# Altium project Monitor_Board_Model_temporary_H202.PrjPcb (part 3 of 3)

## Sheet Sensor_Module.SchDoc: Sensor Module
size A4; DocumentNumber: 7; SheetNumber: 7; SheetTotal: 31
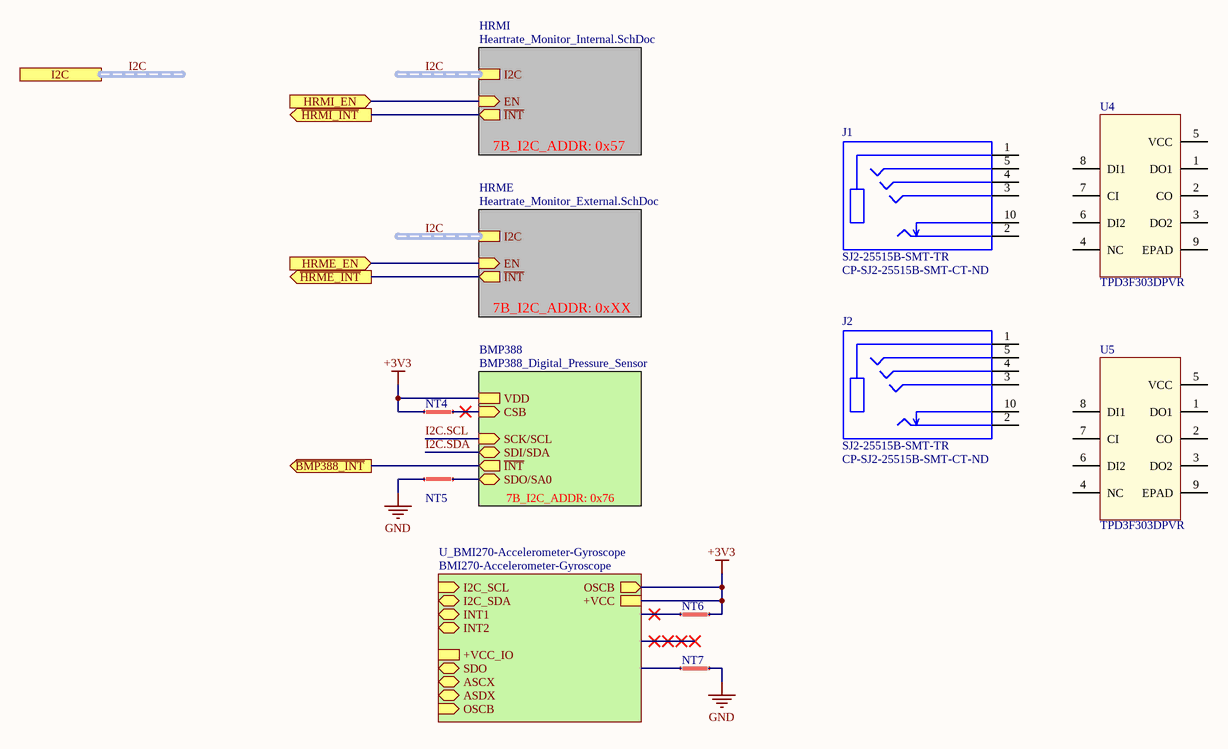
[diagram p11: Sensor_Module.SchDoc]

### Parts
J1  SJ2-25515B-SMT-TR  Supplier Part Number 1: CP-SJ2-25515B-SMT-CT-ND  [CUI_SJ2-25515B-SMT-TR]
J2  SJ2-25515B-SMT-TR  Supplier Part Number 1: CP-SJ2-25515B-SMT-CT-ND  [CUI_SJ2-25515B-SMT-TR]
NT4  Net Tie  [Net Tie 6x30mil]  (value not drawn)  (net tie, no BOM)
NT5  Net Tie  [Net Tie 6x30mil]  (value not drawn)  (net tie, no BOM)
NT6  Net Tie  [Net Tie 6x30mil]  (value not drawn)  (net tie, no BOM)
NT7  Net Tie  [Net Tie 6x30mil]  (value not drawn)  (net tie, no BOM)
U4  TPD3F303DPVR  [DPV8_1P7X0P4]
U5  TPD3F303DPVR  [DPV8_1P7X0P4]

### Sub-sheets
BMP388 = BMP388_Digital_Pressure_Sensor (file not in this document): VDD, SCK/SCL (in), SDI/SDA (bidir), SDO/SA0 (bidir), CSB (in), ~{INT} (out)  | 7B_I2C_ADDR: 0x76
HRME = Heartrate_Monitor_External.SchDoc: I2C (harness I2C), EN (in), ~{INT} (out)  | 7B_I2C_ADDR: 0xXX
HRMI = Heartrate_Monitor_Internal.SchDoc: I2C (harness I2C), EN (in), ~{INT} (out)  | 7B_I2C_ADDR: 0x57
U_BMI270-Accelerometer-Gyroscope = BMI270-Accelerometer-Gyroscope (file not in this document): I2C_SCL (in), I2C_SDA (bidir), INT1 (bidir), INT2 (bidir), +VCC, +VCC_IO, SDO (bidir), ASCX (bidir), ASDX (bidir), OSCB (in), OSCB (out)

### Ports
HRME_EN (in), HRMI_EN (in), I2C (harness I2C), ~{BMP388_INT} (out), ~{HRME_INT} (out), ~{HRMI_INT} (out)

### Nets
+3V3: NT4.1 NT6.2 ; sheet BMP388/VDD, sheet U_BMI270-Accelerometer-Gyroscope/+VCC, sheet U_BMI270-Accelerometer-Gyroscope/OSCB
GND: NT5.2 NT7.2
~{BMP388_INT}: port ~{BMP388_INT}, sheet BMP388/~{INT}
~{HRME_INT}: port ~{HRME_INT}, sheet HRME/~{INT}
~{HRMI_INT}: port ~{HRMI_INT}, sheet HRMI/~{INT}
HRME_EN: port HRME_EN, sheet HRME/EN
HRMI_EN: port HRMI_EN, sheet HRMI/EN
I2C.SCL: sheet BMP388/SCK/SCL
I2C.SDA: sheet BMP388/SDI/SDA
NetNT4_2: NT4.2 ; sheet BMP388/CSB
NetNT5_1: NT5.1 ; sheet BMP388/SDO/SA0

Not connected (* = marked no-connect by the designer): J1 1(OUTER_RING) 2(TIP) 3(RING1) 4(RING2) 5(SLEEVE) 10(TIP_SWITCH); J2 1(OUTER_RING) 2(TIP) 3(RING1) 4(RING2) 5(SLEEVE) 10(TIP_SWITCH); NT6 1*; NT7 1; U4 1(DO1) 2(CO) 3(DO2) 4(NC) 5(VCC) 6(DI2) 7(CI) 8(DI1) 9(EPAD); U5 1(DO1) 2(CO) 3(DO2) 4(NC) 5(VCC) 6(DI2) 7(CI) 8(DI1) 9(EPAD)

### Buses and harness runs
harness I2C = port I2C
harness I2C = sheet HRME/I2C
harness I2C = sheet HRMI/I2C

### Notes on the sheet
- Title
- Size:
- Date:
- A4
- Number:
- Time:
- Revision:
- Sheet
- of
- File:

### Library data of the parts
J1 J2 = SJ2-25515B-SMT-TR: 5 conductor, 2.5 mm, SMT Audio Jack w/ Tip Switch; MF: CUI; Contact: 5(Excludes TIP Switch); Specification: 5-Contact 2.5mm; Package: None; Price: None; Value: *; MP: SJ2-25515B-SMT-TR; Availability: Unavailable; Supplier 1: Digi-Key; Datasheet: https://www.cuidevices.com/product/resource/sj2-2551x-smt.pdf
NT4-NT7 = Net Tie Line: ClassName: Net Tie
U4 U5 = FILTER RC(PI) ESD SMD  8-UFDFN EP: RC (Pi) EMI Filter 2nd Order Low Pass 3 Channel R = 47Ohms, 100Ohms, C = 20pF  8-UFDFN Exposed Pad; Manufacturer: Texas Instruments; Number of Channels: 3; Frequency: 308MHz; ESD Protection: Yes; Operating Supply Voltage: 5.5V; Clamping Voltage: 10V; Supplier 1: Digi-Key; Manufacturer Part Number: TPD3F303DPVR; Stock 1: 4896; Pricing 1: 1=0.85, 10=0.812, 25=0.7856, 50=0.6414, 100=0.576, 250=0.5236, 500=0.4974, 1000=0.4451 (USD); Case/Package: SMD/SMT; Min Operating Temperature: -40°C; Max Operating Temperature: 85°C; Packaging: Tape and Reel; ComponentLink1URL: http://www.ti.com/lit/ds/symlink/tpd3f303.pdf?src-supplier=Digi-Key; ComponentLink1Description: http://www.ti.com/lit/ds/symlink/tpd3f303.pdf?src-supplier=Digi-Key; ComponentLink2URL: http://focus.ti.com/lit/ds/symlink/tpd3f303.pdf?src-supplier=Avnet+Europe; ComponentLink2Description: http://focus.ti.com/lit/ds/symlink/tpd3f303.pdf?src-supplier=Avnet+Europe; ComponentLink3URL: https://www.verical.com/server-webapp/html/getDatasheet?partID=302817&src-supplier=Verical; ComponentLink3Description: https://www.verical.com/server-webapp/html/getDatasheet?partID=302817&src-supplier=Verical; ComponentLink4URL: http://www.farnell.com/datasheets/1558442.pdf?src-supplier=Element14; ComponentLink4Description: http://www.farnell.com/datasheets/1558442.pdf?src-supplier=Element14; Supplier Part Number 1: 296-28299-1-ND; Number of Pins: 8; Contact Plating: Gold; Package Quantity: 1; Capacitance: 20pF; Termination: Flat; Length: 2.2mm; Height: 0.026inch; Width: 0.063inch; Depth: 1.7mm; Radiation Hardening: No; Lead Free: Lead Free; REACH SVHC: No SVHC; Mount: Surface Mount

## Sheet Heartrate_Monitor_External.SchDoc: Heart Rate Monitor External
size A4; DocumentNumber: 10; SheetNumber: 10; SheetTotal: 31
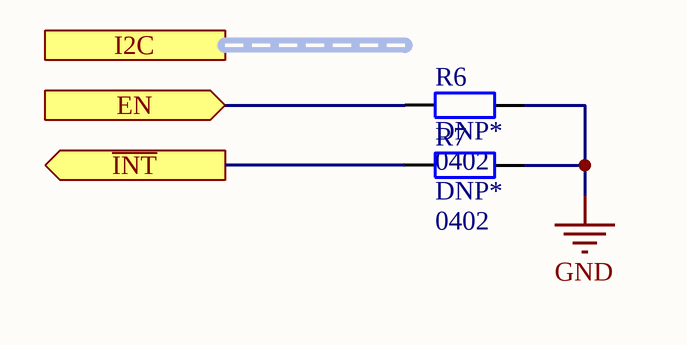
[diagram p12: Heartrate_Monitor_External.SchDoc]

### Parts
R6  DNP*  Case/Package: 0402  [0402R]  (no BOM)
R7  DNP*  Case/Package: 0402  [0402R]  (no BOM)

### Ports
EN (in), I2C (harness I2C), ~{INT} (out)

### Nets
GND: R6.1 R7.1
~{HRME_INT}: R7.2 ; port ~{INT}
HRME_EN: R6.2 ; port EN

### Notes on the sheet
- Title
- Size:
- Date:
- A4
- Number:
- Time:
- Revision:
- Sheet
- of
- File:

### Library data of the parts
R6 R7 = RES SMD NO BOM 0402: Placeholder for a 0402 resistor

## Sheet Heartrate_Monitor_Internal.SchDoc: Heart Rate Monitor Internal
size A4; DocumentNumber: 8; SheetNumber: 8; SheetTotal: 31
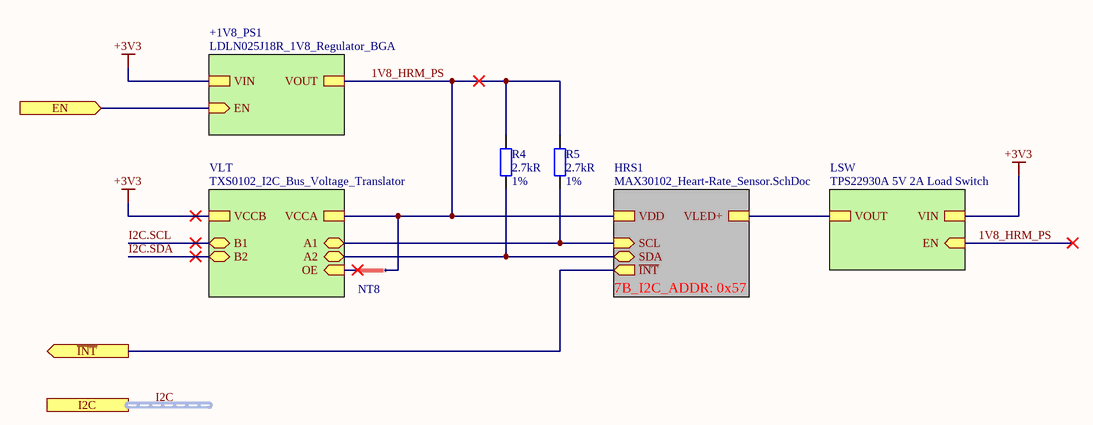
[diagram p13: Heartrate_Monitor_Internal.SchDoc]

### Parts
NT8  Net Tie  [Net Tie 6x30mil]  (value not drawn)  (net tie, no BOM)
R4  Resistance: 2.7kR  Tolerance: 1%  [R0402]  (hidden comment: RES SMD 2.7K OHM 1% 1/16W 0402)
R5  Resistance: 2.7kR  Tolerance: 1%  [R0402]  (hidden comment: RES SMD 2.7K OHM 1% 1/16W 0402)

### Sub-sheets
+1V8_PS1 = LDLN025J18R_1V8_Regulator_BGA (file not in this document): EN (in), VIN, VOUT
HRS1 = MAX30102_Heart-Rate_Sensor.SchDoc: ~{INT} (out), VDD, SCL (in), VLED+, SDA (bidir)  | 7B_I2C_ADDR: 0x57
LSW = TPS22930A 5V 2A Load Switch (file not in this document): EN (in), VOUT, VIN
VLT = TXS0102_I2C_Bus_Voltage_Translator (file not in this document): VCCA, VCCB, OE (in), A1 (bidir), A2 (bidir), B1 (bidir), B2 (bidir)

### Ports
EN (in), I2C (harness I2C), ~{INT} (out)

### Nets
+3V3: sheet +1V8_PS1/VIN, sheet VLT/VCCB, sheet LSW/VIN
1V8_HRM_PS: NT8.2 R4.2 R5.2 ; sheet HRS1/VDD, sheet +1V8_PS1/VOUT, sheet VLT/VCCA, sheet LSW/EN
~{HRMI_INT}: port ~{INT}, sheet HRS1/~{INT}
HRMI_EN: port EN, sheet +1V8_PS1/EN
I2C.SCL: sheet VLT/B1
I2C.SDA: sheet VLT/B2
NetC8_2: sheet HRS1/VLED+, sheet LSW/VOUT
NetNT8_1: NT8.1 ; sheet VLT/OE
NetR4_1: R4.1 ; sheet HRS1/SDA, sheet VLT/A2
NetR5_1: R5.1 ; sheet HRS1/SCL, sheet VLT/A1

### Buses and harness runs
harness I2C = port I2C

### Notes on the sheet
- Title
- Size:
- Date:
- A4
- Number:
- Time:
- Revision:
- Sheet
- of
- File:

### Library data of the parts
NT8 = Net Tie Line: ClassName: Net Tie
R4 R5 = RES SMD 2.7K OHM 1% 1/16W 0402: 2.7 kOhms ±1% 0.063W, 1/16W Chip Resistor 0402 (1005 Metric) Moisture Resistant Thick Film; Manufacturer Part Number: RC0402FR-072K7L; Manufacturer: Yageo; Temperature Coefficient: 100ppm/°C; Voltage Rating: 50V; Power Rating: 63mW; Supplier 1: Digi-Key; Stock 1: 261850; Pricing 1: 1=0.1, 10=0.016, 100=0.0064, 1000=0.0029, 2500=0.0025, 5000=0.0021 (USD); Case Code (Imperial): 0402; Case Code (Metric): 1005; Min Operating Temperature: -55°C; Max Operating Temperature: 155°C; Composition: Thick Film; Packaging: Tape and Reel; Termination: SMD/SMT; Military Standard: Not; Working Voltage: 50V; Number of Terminations: 2; Length: 1mm; Height: 0.016inch; Width: 0.02inch; Depth: 0.5mm; REACH SVHC: Unknown; Lead Free: Lead Free; ComponentLink1URL: http://www.mouser.com/ds/2/447/PYu-RC0402_51_RoHS_L_6_r-8721.pdf?src-supplier=Mouser; ComponentLink1Description: http://www.mouser.com/ds/2/447/PYu-RC0402_51_RoHS_L_6_r-8721.pdf?src-supplier=Mouser; ComponentLink2URL: http://www.yageo.com/documents/recent/PYu-RC_Group_51_RoHS_L_9.pdf?src-supplier=Digi-Key; ComponentLink2Description: http://www.yageo.com/documents/recent/PYu-RC_Group_51_RoHS_L_9.pdf?src-supplier=Digi-Key; ComponentLink3URL: http://www.yageo.com/documents/recent/PYu-RC_Group_51_RoHS_L_10.pdf?src-supplier=Digi-Key; ComponentLink3Description: http://www.yageo.com/documents/recent/PYu-RC_Group_51_RoHS_L_10.pdf?src-supplier=Digi-Key; ComponentLink4URL: http://www.farnell.com/datasheets/2167052.pdf?src-supplier=Element14; ComponentLink4Description: http://www.farnell.com/datasheets/2167052.pdf?src-supplier=Element14; Supplier Part Number 1: 311-2.70KLRCT-ND; Case/Package: 0402; Package Quantity: 1; Max Power Dissipation: 63mW; Features: Moisture Resistant; ClassName: U_ESP32-WROOM32D_Module

## Sheet MAX30102_Heart-Rate_Sensor.SchDoc: MAX30102 Heart-Rate Sensor
size A4; DocumentNumber: 9; SheetNumber: 9; SheetTotal: 31
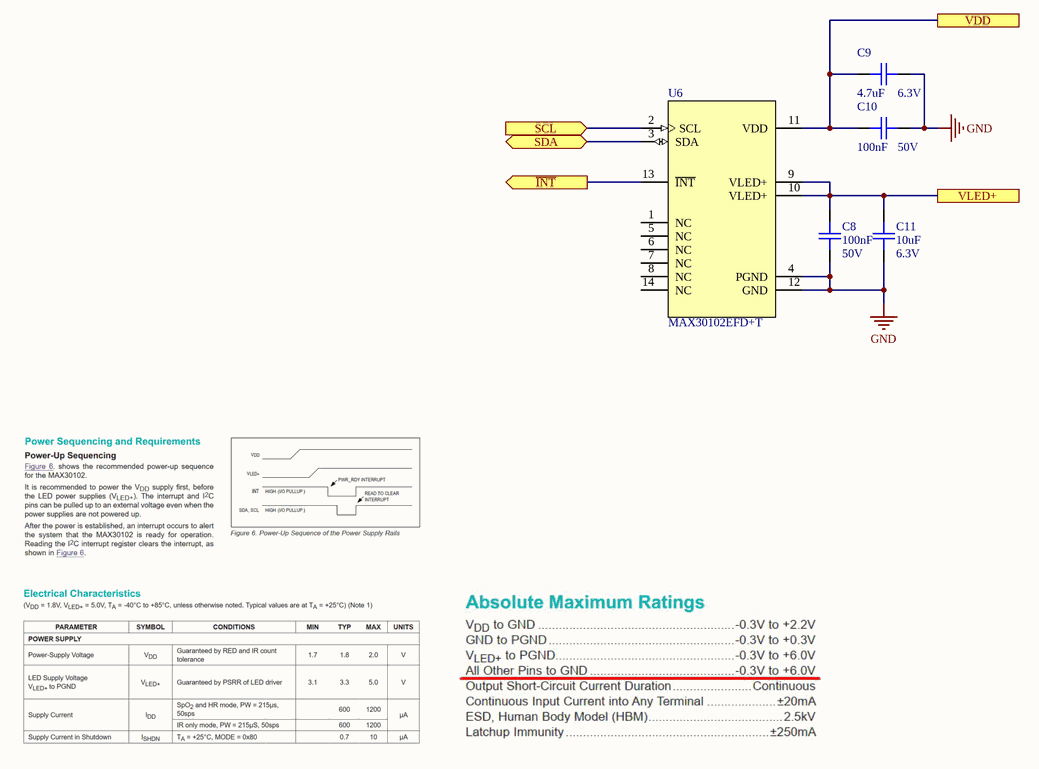
[diagram p14: MAX30102_Heart-Rate_Sensor.SchDoc]

### Parts
C8  Capacitance: 100nF  Voltage: 50V  [C0402]  (hidden comment: CAP CER 0.1UF 50V X7R 0402)
C9  Capacitance: 4.7uF  Voltage Rating: 6.3V  [C0402]  (hidden comment: CAP CER 4.7UF 6.3V X5R 0402)
C10  Capacitance: 100nF  Voltage: 50V  [C0402]  (hidden comment: CAP CER 0.1UF 50V X7R 0402)
C11  Capacitance: 10uF  Voltage Rating: 6.3V  [C0402]  (hidden comment: CAP CER 10UF 6.3V X5R 0402)
U6  MAX30102EFD+T  [XDCR_MAX30101EFD+]

### Ports
SCL (in), SDA (bidir), VDD, VLED+, ~{INT} (out)

### Nets
GND: C8.1 C9.2 C10.2 C11.1 U6.4(PGND) U6.12(GND)
1V8_HRM_PS: C9.1 C10.1 U6.11(VDD) ; port VDD
~{HRMI_INT}: U6.13(~{INT}) ; port ~{INT}
NetC8_2: C8.2 C11.2 U6.9(VLED+) U6.10(VLED+) ; port VLED+
NetR4_1: U6.3(SDA) ; port SDA
NetR5_1: U6.2(SCL) ; port SCL

Not connected (* = marked no-connect by the designer): U6 1(NC) 5(NC) 6(NC) 7(NC) 8(NC) 14(NC)

### Notes on the sheet
- Title
- Size:
- Date:
- A4
- Number:
- Time:
- Revision:
- Sheet
- of
- File:

### Library data of the parts
C8 C10 = CAP CER 0.1UF 50V X7R 0402: 0.1µF ±10% 50V Ceramic Capacitor X7R 0402 (1005 Metric); Manufacturer: TDK; Manufacturer Part Number: CGA2B3X7R1H104K050BB; Supplier 1: Digi-Key; Stock 1: 2925303; Pricing 1: 1=0.17, 10=0.118, 50=0.0668, 100=0.0553, 500=0.0388, 1000=0.0321, 2500=0.0299, 5000=0.0273 (USD); Mount: Surface Mount; Case/Package: 0402; Weight: 2.3E-05oz; Case Code (Metric): 1005; Case Code (Imperial): 0402; Min Operating Temperature: -55°C; Max Operating Temperature: 125°C; Voltage Rating: 50V; Tolerance: 10%; Packaging: Tape and Reel; Package Quantity: 1; Voltage Rating (DC): 50V; Dielectric: X7R; Termination: SMD/SMT; Composition: Ceramic; Length: 1mm; Height: 0.5mm; Width: 0.02inch; Thickness: 0.022inch; Depth: 0.5mm; Ratings: AEC-Q200; REACH SVHC: No SVHC; Lead Free: Lead Free; ComponentLink1URL: http://product.tdk.com/capacitor/mlcc/en/documents/mlccspec_automotive_general_midvoltage_en.pdf?src-supplier=Future+Electronics; ComponentLink1Description: http://product.tdk.com/capacitor/mlcc/en/documents/mlccspec_automotive_general_midvoltage_en.pdf?src-supplier=Future+Electronics; ComponentLink2URL: http://www.farnell.com/datasheets/1807242.pdf?src-supplier=Element14; ComponentLink2Description: http://www.farnell.com/datasheets/1807242.pdf?src-supplier=Element14; ComponentLink3URL: http://www.mouser.com/ds/2/400/lcc_automotive_general_en-843974.pdf?src-supplier=Mouser; ComponentLink3Description: http://www.mouser.com/ds/2/400/lcc_automotive_general_en-843974.pdf?src-supplier=Mouser; ComponentLink4URL: http://www.farnell.com/datasheets/1936565.pdf?src-supplier=Element14; ComponentLink4Description: http://www.farnell.com/datasheets/1936565.pdf?src-supplier=Element14; ComponentLink5URL: http://www.farnell.com/datasheets/1735392.pdf?src-supplier=Element14; ComponentLink5Description: http://www.farnell.com/datasheets/1735392.pdf?src-supplier=Element14; Supplier Part Number 1: 445-6899-1-ND
C9 = CAP CER 4.7UF 6.3V X5R 0402: 4.7µF ±20% 6.3V Ceramic Capacitor X5R 0402 (1005 Metric); Manufacturer: Samsung; Manufacturer Part Number: CL05A475MQ5NRNC; Supplier 1: Digi-Key; Stock 1: 746765; Pricing 1: 1=0.14, 10=0.099, 50=0.0564, 100=0.0467, 500=0.0327, 1000=0.0271, 2500=0.0252, 5000=0.0231 (USD); Mount: Surface Mount; Case/Package: 0402; Case Code (Metric): 1005; Case Code (Imperial): 0402; Min Operating Temperature: -55°C; Max Operating Temperature: 85°C; Tolerance: 20%; Packaging: Tape and Reel; Series: CL; Length: 0.039inch; Width: 0.02inch; Thickness: 0.022inch; RoHS Compliant: Yes; ComponentLink1URL: https://www.verical.com/server-webapp/html/getDatasheet?partID=359681&src-supplier=Verical; ComponentLink1Description: https://www.verical.com/server-webapp/html/getDatasheet?partID=359681&src-supplier=Verical; ComponentLink2URL: http://www1.futureelectronics.com/doc/SAMSUNG/CL05A475MQ5NRNC.pdf?src-supplier=Future+Electronics; ComponentLink2Description: http://www1.futureelectronics.com/doc/SAMSUNG/CL05A475MQ5NRNC.pdf?src-supplier=Future+Electronics; Supplier Part Number 1: 1276-1056-1-ND
C11 = CAP CER 10UF 6.3V X5R 0402: 10µF ±20% 6.3V Ceramic Capacitor X5R 0402 (1005 Metric); Manufacturer: Samsung; Manufacturer Part Number: CL05A106MQ5NUNC; Supplier 1: Digi-Key; Stock 1: 1544395; Pricing 1: 1=0.27, 10=0.187, 50=0.1248, 100=0.1061, 500=0.0749, 1000=0.0655, 2500=0.0624, 5000=0.0577 (USD); Mount: Surface Mount; Case/Package: 0402; Case Code (Metric): 1005; Case Code (Imperial): 0402; Min Operating Temperature: -55°C; Max Operating Temperature: 85°C; Tolerance: 20%; Dielectric: X5R; Packaging: Tape and Reel; Package Quantity: 1; Series: CL; Construction: Flat; Length: 1mm; Width: 0.02inch; Height: 0.5mm; Thickness: 0.028inch; Depth: 0.5mm; Radiation Hardening: No; ComponentLink1URL: https://www.verical.com/server-webapp/html/getDatasheet?partID=355289&src-supplier=Verical; ComponentLink1Description: https://www.verical.com/server-webapp/html/getDatasheet?partID=355289&src-supplier=Verical; ComponentLink2URL: http://www1.futureelectronics.com/doc/SAMSUNG/CL05A106MQ5NUNC.pdf?src-supplier=Future+Electronics; ComponentLink2Description: http://www1.futureelectronics.com/doc/SAMSUNG/CL05A106MQ5NUNC.pdf?src-supplier=Future+Electronics; Supplier Part Number 1: 1276-1451-1-ND
U6 = IC MAX30102EFD+T INTEGRATED OPTICAL SENSOR: Oximeter/Heart Rate Sensor IÂ²C Output; Manufacturer: Maxim; Output Type: I2C; Supplier 1: Digi-Key; Manufacturer Part Number: MAX30102EFD+T; Stock 1: 4064; Pricing 1: 1=9.76, 10=8.815, 25=8.61 (USD); Min Operating Temperature: -40°C; Max Operating Temperature: 85°C; RoHS Compliant: Yes; ComponentLink1URL: https://datasheets.maximintegrated.com/en/ds/MAX30102.pdf?src-supplier=Digi-Key; ComponentLink1Description: https://datasheets.maximintegrated.com/en/ds/MAX30102.pdf?src-supplier=Digi-Key; Supplier Part Number 1: MAX30102EFD+TCT-ND

## Sheet SWD_TagConnect.SchDoc: Tag-Connect SWD Port
size A4; DocumentNumber: 5; SheetNumber: 5; SheetTotal: 50
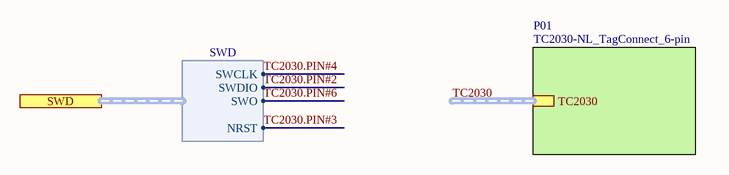
[diagram p15: SWD_TagConnect.SchDoc]

### Sub-sheets
P01 = TC2030-NL_TagConnect_6-pin (file not in this document): TC2030 (harness TC2030)

### Ports
SWD (harness SWD)

### Harnesses
SWD: SWDIO, SWCLK, NRST, SWO

### Buses and harness runs
harness TC2030 = sheet P01/TC2030

### Notes on the sheet
- Title
- Size:
- Date:
- A4
- Number:
- Time:
- Revision:
- Sheet
- of
- File:

## Sheet UART_TagConnect.SchDoc: Tag-Connect DEBUG Port
size A4; DocumentNumber: 6; SheetNumber: 6; SheetTotal: 50
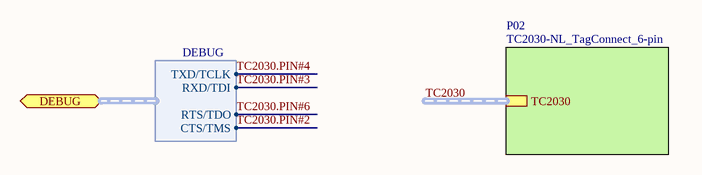
[diagram p16: UART_TagConnect.SchDoc]

### Sub-sheets
P02 = TC2030-NL_TagConnect_6-pin (file not in this document): TC2030 (harness TC2030)

### Ports
DEBUG (harness DEBUG)

### Harnesses
DEBUG: TXD/TCLK, RXD/TDI, RTS/TDO, CTS/TMS

### Buses and harness runs
harness TC2030 = sheet P02/TC2030

### Notes on the sheet
- Title
- Size:
- Date:
- A4
- Number:
- Time:
- Revision:
- Sheet
- of
- File:

## Sheet SIT1533_Oscillator.SchDoc: SIT1533 RTC 32.768 kHz Oscillator
size A4; DocumentNumber: 3; SheetNumber: 3; SheetTotal: 31
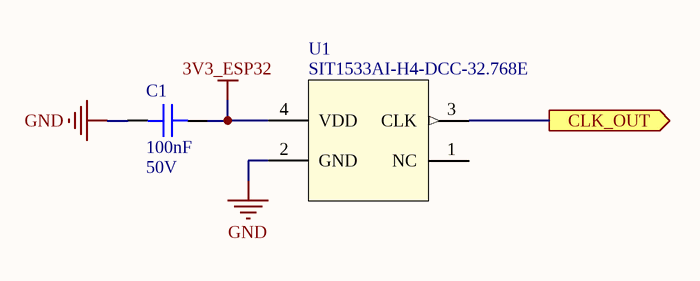
[diagram p17: SIT1533_Oscillator.SchDoc]

### Parts
(Parts that share a designator on the sheet are numbered #1, #2 ... from top to bottom, then left to right.)
C1#2  Capacitance: 100nF  Voltage: 50V  [C0402]  (hidden comment: CAP CER 0.1UF 50V X7R 0402)
U1#2  Manufacturer Part Number: SIT1533AI-H4-DCC-32.768E  [XTAL4_SiT1533_SIT]  (hidden comment: IC SIT1533AI-H4-DCC-32.768E MEMS OSC XO 32.7680KHZ LVCMOS)

### Ports
CLK_OUT (out)

### Nets
3V3_ESP32: C1#2.2 U1#2.4(VDD)
GND: C1#2.1 U1#2.2(GND)
NetU1#2_3: U1#2.3(CLK) ; port CLK_OUT

Not connected (* = marked no-connect by the designer): U1#2 1(NC)

### Notes on the sheet
- Title
- Size:
- Date:
- A4
- Number:
- Time:
- Revision:
- Sheet
- of
- File:

### Library data of the parts
C1#2 = CAP CER 0.1UF 50V X7R 0402: as C8 on sheet MAX30102_Heart-Rate_Sensor; Supplier 1: Digi-Key; Stock 1: 2925303; Pricing 1: 1=0.17, 10=0.118, 50=0.0668, 100=0.0553, 500=0.0388, 1000=0.0321, 2500=0.0299, 5000=0.0273 (USD); Mount: Surface Mount; Case/Package: 0402; Weight: 2.3E-05oz; Case Code (Metric): 1005; Case Code (Imperial): 0402; Min Operating Temperature: -55°C; Max Operating Temperature: 125°C; Voltage Rating: 50V; Tolerance: 10%; Packaging: Tape and Reel; Package Quantity: 1; Voltage Rating (DC): 50V; Dielectric: X7R; Termination: SMD/SMT; Composition: Ceramic; Length: 1mm; Height: 0.5mm; Width: 0.02inch; Thickness: 0.022inch; Depth: 0.5mm; Ratings: AEC-Q200; REACH SVHC: No SVHC; Lead Free: Lead Free; ComponentLink1URL: http://product.tdk.com/capacitor/mlcc/en/documents/mlccspec_automotive_general_midvoltage_en.pdf?src-supplier=Future+Electronics; ComponentLink1Description: http://product.tdk.com/capacitor/mlcc/en/documents/mlccspec_automotive_general_midvoltage_en.pdf?src-supplier=Future+Electronics; ComponentLink2URL: http://www.farnell.com/datasheets/1807242.pdf?src-supplier=Element14; ComponentLink2Description: http://www.farnell.com/datasheets/1807242.pdf?src-supplier=Element14; ComponentLink3URL: http://www.mouser.com/ds/2/400/lcc_automotive_general_en-843974.pdf?src-supplier=Mouser; ComponentLink3Description: http://www.mouser.com/ds/2/400/lcc_automotive_general_en-843974.pdf?src-supplier=Mouser; ComponentLink4URL: http://www.farnell.com/datasheets/1936565.pdf?src-supplier=Element14; ComponentLink4Description: http://www.farnell.com/datasheets/1936565.pdf?src-supplier=Element14; ComponentLink5URL: http://www.farnell.com/datasheets/1735392.pdf?src-supplier=Element14; ComponentLink5Description: http://www.farnell.com/datasheets/1735392.pdf?src-supplier=Element14; Supplier Part Number 1: 445-6899-1-ND; ClassName: MCU
U1#2 = IC SIT1533AI-H4-DCC-32.768E MEMS OSC XO 32.7680KHZ LVCMOS: 32.768kHz XO (Standard) LVCMOS Oscillator 1.5V ~ 3.63V  4-SMD, No Lead; Manufacturer: SiTime; Frequency Stability: 100ppm; Max Supply Current: 1.4uA; Load Capacitance: 10pF; Current Rating: 1.35uA; Max Duty Cycle: 52%; Supplier 1: Digi-Key; Stock 1: 89278; Pricing 1: 1=1.1, 10=0.975, 50=0.9116, 100=0.8056, 500=0.7632 (USD); Mount: Surface Mount; Case/Package: SMD/SMT; Number of Pins: 4; Min Operating Temperature: -40°C; Max Operating Temperature: 85°C; Packaging: Tape and Reel; Frequency: 32.768kHz; Termination: SMD/SMT; Min Supply Voltage: 1.5V; Max Supply Voltage: 3.63V; Package Quantity: 1000; Length: 0.079inch; Width: 0.047inch; Height: 0.024inch; RoHS Compliant: Yes; ComponentLink1URL: https://www.sitime.com/datasheet/SiT1533?src-supplier=Digi-Key; ComponentLink1Description: https://www.sitime.com/datasheet/SiT1533?src-supplier=Digi-Key; ComponentLink2URL: http://www.mouser.com/ds/2/371/SiT1533-datasheet-275337.pdf?src-supplier=Mouser; ComponentLink2Description: http://www.mouser.com/ds/2/371/SiT1533-datasheet-275337.pdf?src-supplier=Mouser; ComponentLink3URL: http://components.arrow.com/part/dataview/0323_07137603?src-supplier=Arrow+Europe; ComponentLink3Description: http://components.arrow.com/part/dataview/0323_07137603?src-supplier=Arrow+Europe; Supplier Part Number 1: 1473-1239-1-ND; ClassName: MCU

## Nets that join several sheets
3V3_ESP32: Test_Points (TP5.1), bq25157_Battery_Charger (C17.1 U9.E1 U9.E4), Audio_Module (NT1.1), AUDIO/MIC1 (C1#1.2 U1#1.2), AUDIO/MIC2 (C2.2 U2.2), CMX655D_Audio_CODEC_PA (C3.2 U3.7 U3.8), SIT1533_Oscillator (C1#2.2 U1#2.4)
+3V3: Test_Points (TP6.1), bq25157_Battery_Charger (C18.1 U9.D4), Sensor_Module (NT4.1 NT6.2)
GND: Test_Points (7 pins), Power_Domain (D1.2 D2.2 X1.3), Micro_USB_Port (9 pins), bq25157_Battery_Charger (8 pins), Membrane_Keypad (6 pins), Audio_Module (NT2.1 NT3.1), AUDIO/MIC1 (C1#1.1 U1#1.5), AUDIO/MIC2 (C2.1 U2.5), CMX655D_Audio_CODEC_PA (8 pins), Sensor_Module (NT5.2 NT7.2), Heartrate_Monitor_External (R6.1 R7.1), MAX30102_Heart-Rate_Sensor (6 pins), SIT1533_Oscillator (C1#2.1 U1#2.2)
VBUS: Test_Points (TP8.1), Micro_USB_Port (C12.2 C13.2 D3.1 J3.1), bq25157_Battery_Charger (C15.2 U9.A1)
VSYS: Test_Points (TP7.1), Power_Domain (NT9.2), bq25157_Battery_Charger (C16.1 U9.A2 U9.B2), Visual_User_Interface (D4.A)
1V8_HRM_PS: Heartrate_Monitor_Internal (NT8.2 R4.2 R5.2), MAX30102_Heart-Rate_Sensor (C9.1 C10.1 U6.11)
1V8_VDD: bq25157_Battery_Charger (C19.2 U9.D1), Membrane_Keypad (R8.2)
~{MR}: bq25157_Battery_Charger (U9.C1), Membrane_Keypad (U8.5 X2.8)
ADCIN: bq25157_Battery_Charger (U9.C4), Membrane_Keypad (9 pins)
LR_SEL1: Audio_Module (NT1.2), AUDIO/MIC1 (U1#1.4)
LR_SEL2: Audio_Module (NT2.2), AUDIO/MIC2 (U2.4)
MICCLK: Audio_Module (R1.2), CMX655D_Audio_CODEC_PA (U3.10)
MICDO: AUDIO/MIC1 (R2.1), AUDIO/MIC2 (R3#1.1), CMX655D_Audio_CODEC_PA (U3.11)
NetD1_1: Power_Domain (D1.1 X1.1), bq25157_Battery_Charger (U9.A3 U9.B3)
NetD2_1: Power_Domain (D2.1 X1.2), bq25157_Battery_Charger (R16.2 U9.B4)
NetNT3_2: Audio_Module (NT3.2), CMX655D_Audio_CODEC_PA (U3.17 U3.21 U3.22)
NetR1_1: Audio_Module (R1.1), AUDIO/MIC1 (U1#1.3), AUDIO/MIC2 (U2.3)
NetR4_1: Heartrate_Monitor_Internal (R4.1), MAX30102_Heart-Rate_Sensor (U6.3)
NetR5_1: Heartrate_Monitor_Internal (R5.1), MAX30102_Heart-Rate_Sensor (U6.2)
NetU3_1: Audio_Module (Y1.M), CMX655D_Audio_CODEC_PA (U3.1)
NetU3_23: Audio_Module (Y1.P), CMX655D_Audio_CODEC_PA (U3.23)